# EAGLE design dawa_v5.5 (EAGLE 7.4.0)
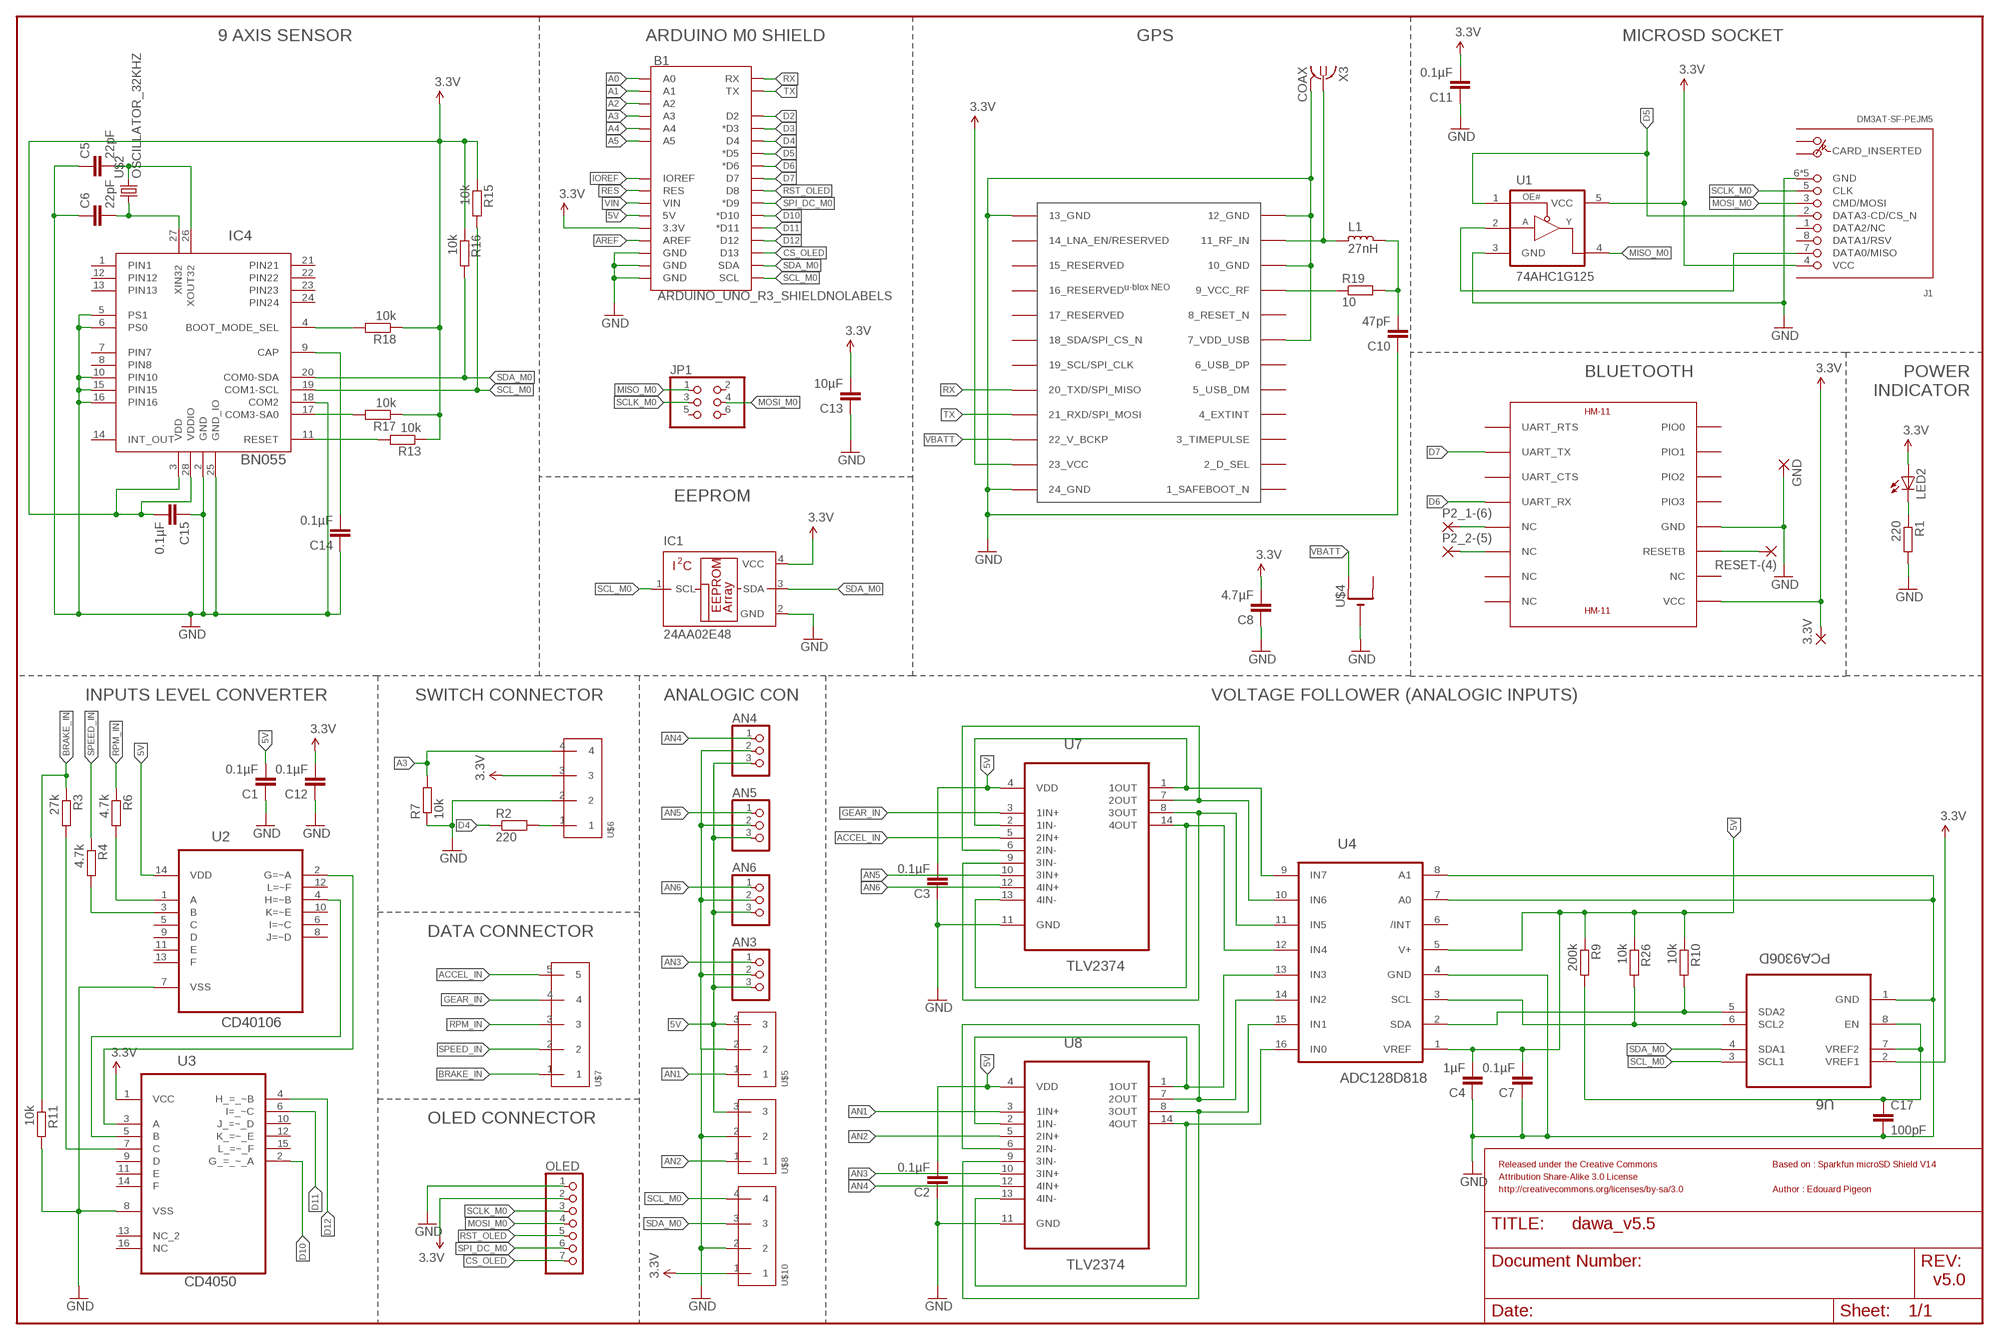
[diagram p0: schematic, sheet 1, part 1 of 2]
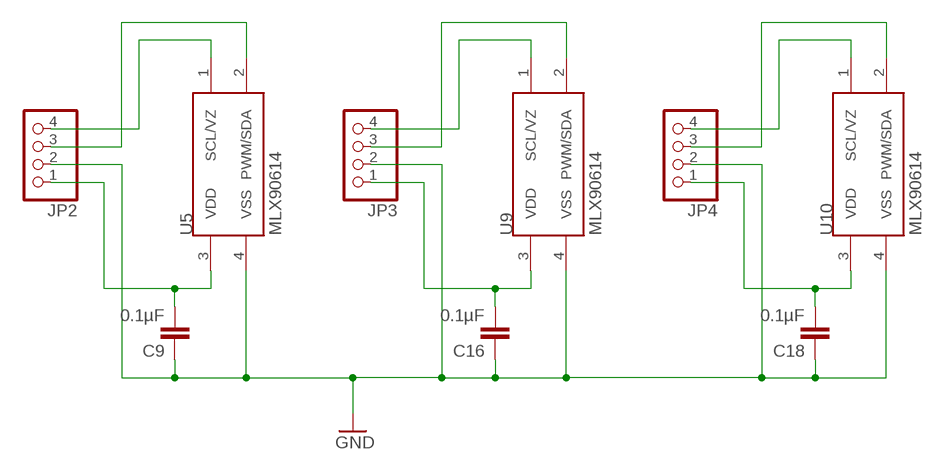
[diagram p1: schematic, sheet 1, part 2 of 2]

## Parts
3.3V  WIREPADSMD1,27-254  [SMD1,27-2,54]
AN3  PINHD-1X3  [1X03]
AN4  PINHD-1X3  [1X03]
AN5  PINHD-1X3  [1X03]
AN6  PINHD-1X3  [1X03]
B1  ARDUINO_UNO_R3_SHIELDNOLABELS  [UNO_R3_SHIELD_NOLABELS]
C1  0.1µF  C-EUC0603  [C0603]
C2  0.1µF  C-EUC0603  [C0603]
C3  0.1µF  C-EUC0603  [C0603]
C4  1µF  C-EUC0603  [C0603]
C5  22pF  C-EUC0603  [C0603]
C6  22pF  C-EUC0603  [C0603]
C7  0.1µF  C-EUC0603  [C0603]
C8  4.7µF  C-EUC0603  [C0603]
C9  0.1µF  C-EUC0603  [C0603]
C10  47pF  C-EUC0603  [C0603]
C11  0.1µF  C-EUC0603  [C0603]
C12  0.1µF  C-EUC0603  [C0603]
C13  10µF  C-EUC0603  [C0603]
C14  0.1µF  C-EUC0603  [C0603]
C15  0.1µF  C-EUC0603  [C0603]
C16  0.1µF  C-EUC0603  [C0603]
C17  100pF  C-EUC0603  [C0603]
C18  0.1µF  C-EUC0603  [C0603]
GND  WIREPADSMD1,27-254  [SMD1,27-2,54]
IC1  24AA02E48  24AA00OT  [SOT23-5L]
IC4  BN055  1658_BNO055  [LGA-28_3.80X5.20/0.5]
J1  DM3AT-SF-PEJM5  [DM3AT-SF-PEJM5]
JP1  PINHD-2X3  [2X03]
JP2  PINHD-1X4  [1X04]
JP3  PINHD-1X4  [1X04]
JP4  PINHD-1X4  [1X04]
L1  27nH  L_0603  [L0603]
LED2  LEDCHIPLED_1206  [CHIPLED_1206]
OLED  PINHD-1X7  [1X07]
P2_1-(6)  WIREPADSMD1,27-254  [SMD1,27-2,54]
P2_2-(5)  WIREPADSMD1,27-254  [SMD1,27-2,54]
R1  220  R-EU_R0603  [R0603]
R2  220  R-EU_R0603  [R0603]
R3  27k  R-EU_R0603  [R0603]
R4  4.7k  R-EU_R0603  [R0603]
R6  4.7k  R-EU_R0603  [R0603]
R7  10k  R-EU_R0603  [R0603]
R9  200k  R-EU_R0603  [R0603]
R10  10k  R-EU_R0603  [R0603]
R11  10k  R-EU_R0603  [R0603]
R13  10k  R-EU_R0603  [R0603]
R15  10k  R-EU_R0603  [R0603]
R16  10k  R-EU_R0603  [R0603]
R17  10k  R-EU_R0603  [R0603]
R18  10k  R-EU_R0603  [R0603]
R19  10  R-EU_M1206  [M1206]
R26  10k  R-EU_R0603  [R0603]
RESET-(4)  WIREPADSMD1,27-254  [SMD1,27-2,54]
U1  74AHC1G125  74AHC1G125DBV  [SOT23-5]
U2  CD40106  CD40106BPW  [SOP65P640X120-14N]
U3  CD4050  CD4049UBPW  [SOP65P640X120-16N]
U4  ADC128D818  [SOP65P640X120-16N]
U5  MLX90614  MLX90614_  [TO-39]
U6  PCA9306D  PCA9306DCUT  [SOP50P310X90-8N]
U7  TLV2374  TLV2374IPWR  [SOP65P640X120-14N]
U8  TLV2374  TLV2374IPWR  [SOP65P640X120-14N]
U9  MLX90614  MLX90614_  [TO-39]
U10  MLX90614  MLX90614_  [TO-39]
U$1  HM-11  [HM-11]
U$2  OSCILLATOR_32KHZ  [OSCILLATOR_SMD]
U$3  NEO-M8  [NEO-M8]
U$4  CR1220SMT  [CR1220-SMD]
U$5  3_PIN_JST-XH-SMD  [3_PIN_JST-XH-SMD]
U$6  4_PIN_JST-XH-SMD  [4_PIN_JST-XH-SMD]
U$7  5_PIN_JST-XH-SMD  [5_PIN_JST-XH-SMD]
U$8  3_PIN_JST-XH-SMD  [3_PIN_JST-XH-SMD]
U$10  4_PIN_JST-XH-SMD  [4_PIN_JST-XH-SMD]
X3  COAX  [MMCX-J-P-X-ST-EM1-MKT]

## Nets
3.3V: 3.3V.1(P) B1.3.3V C8.2 C11.2 C12.2 C13.2 C15.2 IC1.4(VCC) IC4.3(VDD) IC4.28(VDDIO) J1.4(VCC) LED2.A OLED.2 R13.1 R15.1 R16.1 R17.1 R18.1 U1.5(VCC) U3.1(VCC) U6.2(VREF1) U$1.VCC U$3.23(23_VCC) U$6.3 U$10.1
5V: AN3.3 AN4.3 AN5.3 AN6.3 B1.5V C1.2 C2.2 C3.2 C4.2 C7.2 R9.1 R10.1 R26.1 U2.14(VDD) U4.1(VREF) U4.5(V+) U7.4(VDD) U8.4(VDD) U$5.3 U$8.3
A0: B1.A0
A1: B1.A1
A2: B1.A2
A3: B1.A3 R7.2 U$6.4
A4: B1.A4
A5: B1.A5
ACCEL_IN: U7.5(2IN+) U$7.5
AN1: U8.3(1IN+) U$5.1
AN2: U8.5(2IN+) U$8.1
AN3: AN3.1 U8.10(3IN+)
AN4: AN4.1 U8.12(4IN+)
AN5: AN5.1 U7.10(3IN+)
AN6: AN6.1 U7.12(4IN+)
AREF: B1.AREF
BRAKE_IN: R3.1 R11.1 U$7.1
CS_OLED: B1.D13 OLED.7
D2: B1.D2
D3: B1.D3(*D3)
D4: B1.D4 R2.1
D5: B1.D5(*D5) J1.2(DATA3-CD/CS_N) U1.1(OE#)
D6: B1.D6(*D6) U$1.UART_RX
D7: B1.D7 U$1.UART_TX
D10: B1.D10(*D10) U3.2(G_=_~_A)
D11: B1.D11(*D11) U3.6(I=_~C)
D12: B1.D12 U3.4(H_=_~B)
GEAR_IN: U7.3(1IN+) U$7.4
GND: AN3.2 AN4.2 AN5.2 AN6.2 B1.GND@0(GND) B1.GND@1(GND) B1.GND@2(GND) C1.1 C2.1 C3.1 C4.1 C5.1 C6.1 C7.1 C8.1 C9.1 C10.1 C11.1 C12.1 C13.1 C14.1 C15.1 C16.1 C17.2 C18.1 GND.1(P) IC1.2(GND) IC4.2(GND) IC4.5(PS1) IC4.6(PS0) IC4.10(PIN10) IC4.15(PIN15) IC4.16(PIN16) IC4.18(COM2) IC4.25(GND_IO) J1.6(GND) J1.MOUNT0(GND) J1.MOUNT1(GND) J1.MOUNT2(GND) J1.MOUNT3(GND) JP2.2 JP3.2 JP4.2 OLED.1 R1.2 R7.1 R11.2 U1.3(GND) U2.7(VSS) U3.8(VSS) U4.4(GND) U4.7(A0) U4.8(A1) U5.4(VSS) U6.1(GND) U7.11(GND) U8.11(GND) U9.4(VSS) U10.4(VSS) U$1.GND U$3.7(7_VDD_USB) U$3.10(10_GND) U$3.12(12_GND) U$3.13(13_GND) U$3.24(24_GND) U$4.- U$5.2 U$6.2 U$8.2 U$10.2 X3.2@1(GND)
IOREF: B1.IOREF
MISO_M0: JP1.1 U1.4(Y)
MOSI_M0: J1.3(CMD/MOSI) JP1.4 OLED.4
N$1: R2.2 U$6.1
N$2: R6.2 U2.1(A)
N$3: U2.2(G=~A) U3.3(A)
N$4: R4.2 U2.3(B)
N$5: R3.2 U3.7(C)
N$6: LED2.C R1.1
N$7: IC4.11(RESET) R13.2
N$8: P2_1-(6).1(P) U$1.NC@5(NC)
N$9: RESET-(4).1(P) U$1.RESETB
N$10: J1.7(DATA0/MISO) U1.2(A)
N$11: C10.2 L1.1 R19.2
N$12: U4.13(IN3) U8.1(1OUT) U8.2(1IN-)
N$13: C14.2 IC4.9(CAP)
N$14: IC4.4(BOOT_MODE_SEL) R18.2
N$15: C5.2 IC4.26(XOUT32) U$2.2
N$16: C6.2 IC4.27(XIN32) U$2.1
N$17: IC4.17(COM3-SA0) R17.2
N$18: P2_2-(5).1(P) U$1.NC@6(NC)
N$19: R19.1 U$3.9(9_VCC_RF)
N$20: L1.2 U$3.11(11_RF_IN) X3.1
N$21: U2.4(H=~B) U3.5(B)
N$22: R26.2 U4.3(SCL) U6.6(SCL2)
N$23: R10.2 U4.2(SDA) U6.5(SDA2)
N$24: U4.9(IN7) U7.1(1OUT) U7.2(1IN-)
N$25: U4.10(IN6) U7.6(2IN-) U7.7(2OUT)
N$26: U4.11(IN5) U7.8(3OUT) U7.9(3IN-)
N$27: U4.12(IN4) U7.13(4IN-) U7.14(4OUT)
N$28: C17.1 R9.2 U6.7(VREF2) U6.8(EN)
N$29: U4.14(IN2) U8.6(2IN-) U8.7(2OUT)
N$30: U4.15(IN1) U8.8(3OUT) U8.9(3IN-)
N$31: U4.16(IN0) U8.13(4IN-) U8.14(4OUT)
N$32: JP4.3 U10.2(PWM/SDA)
N$33: JP4.4 U10.1(SCL/VZ)
N$34: JP2.3 U5.2(PWM/SDA)
N$35: JP2.4 U5.1(SCL/VZ)
N$36: JP3.3 U9.2(PWM/SDA)
N$37: C9.2 JP2.1 U5.3(VDD)
N$38: JP3.4 U9.1(SCL/VZ)
N$39: C16.2 JP3.1 U9.3(VDD)
N$40: C18.2 JP4.1 U10.3(VDD)
RES: B1.RES
RPM_IN: R6.1 U$7.3
RST_OLED: B1.D8 OLED.5
RX: B1.RX U$3.20(20_TXD/SPI_MISO)
SCL_M0: B1.SCL IC1.1(SCL) IC4.19(COM1-SCL) R15.2 U6.3(SCL1) U$10.4
SCLK_M0: J1.5(CLK) JP1.3 OLED.3
SDA_M0: B1.SDA IC1.3(SDA) IC4.20(COM0-SDA) R16.2 U6.4(SDA1) U$10.3
SPEED_IN: R4.1 U$7.2
SPI_DC_M0: B1.D9(*D9) OLED.6
TX: B1.TX U$3.21(21_RXD/SPI_MOSI)
VBATT: U$3.22(22_V_BCKP) U$4.+$1(+)
VIN: B1.VIN
Unconnected: IC4.1(PIN1) IC4.7(PIN7) IC4.8(PIN8) IC4.12(PIN12) IC4.13(PIN13) IC4.14(INT_OUT) IC4.21(PIN21) IC4.22(PIN22) IC4.23(PIN23) IC4.24(PIN24) J1.1(DATA2/NC) J1.8(DATA1/RSV) J1.A J1.B JP1.2 JP1.5 JP1.6 U2.5(C) U2.6(I=~C) U2.8(J=~D) U2.9(D) U2.10(K=~E) U2.11(E) U2.12(L=~F) U2.13(F) U3.9(D) U3.10(J_=~_D) U3.11(E) U3.12(K_=~_E) U3.13(NC_2) U3.14(F) U3.15(L_=~_F) U3.16(NC) U4.6(/INT) U$1.NC@7(NC) U$1.NC@8(NC) U$1.NC@10(NC) U$1.PIO0 U$1.PIO1 U$1.PIO2 U$1.PIO3 U$1.UART_CTS U$1.UART_RTS U$3.1(1_SAFEBOOT_N) U$3.2(2_D_SEL) U$3.3(3_TIMEPULSE) U$3.4(4_EXTINT) U$3.5(5_USB_DM) U$3.6(6_USB_DP) U$3.8(8_RESET_N) U$3.14(14_LNA_EN/RESERVED) U$3.15(15_RESERVED) U$3.16(16_RESERVED) U$3.17(17_RESERVED) U$3.18(18_SDA/SPI_CS_N) U$3.19(19_SCL/SPI_CLK) U$4.+$2(+1)

## Notes on the sheet
- 9 AXIS SENSOR | ARDUINO M0 SHIELD | GPS | MICROSD SOCKET
- POWER
  INDICATOR
- BLUETOOTH
- EEPROM
- INPUTS LEVEL CONVERTER
- SWITCH CONNECTOR | ANALOGIC CON | VOLTAGE FOLLOWER (ANALOGIC INPUTS)
- DATA CONNECTOR
- OLED CONNECTOR
- Released under the Creative Commons | Based on : Sparkfun microSD Shield V14
- Attribution Share-Alike 3.0 License
- http://creativecommons.org/licenses/by-sa/3.0 | Author : Edouard Pigeon
- v5.0

## Power pins joined to a net without a drawn wire
GND: X3.2@2(GND) X3.2@3(GND) X3.2@4(GND)

## Library data of the parts
3.3V GND P2_1-(6) P2_2-(5) RESET-(4) = wirepad:WIREPAD: Wire PAD connect wire on PCB
AN3-AN6 = adafruit:PINHD-1X3: PIN HEADER
B1 = SparkFun-Boards-resize:ARDUINO_UNO_R3_SHIELD: Arduino R3 Shield Footprint Shield form compatible with the Arduino Uno R3. SparkFun Products: MG2639 Cellular Shield <https://www.sparkfun.com/products/13120> MIDI Shield <https://www.sparkfun.com/products/12898> R3 Stackable Headers Kit <https://www.sparkfun.com/products/11417>
C1-C18 = rcl:C-EU: CAPACITOR, European symbol
IC1 = microchip:24*00: Serial EEPROM 128 bit, I2C (AA = 1.8 V/LC = 2.5 V/C = 5.0 V); MF: MICROCHIP; MPN: 24AA00T-I/OTG; OC_FARNELL: 1331264; OC_NEWARK: 89H3038
IC4 = BNO055-2:1658_BNO055: BN055 Intelligent 9-axis absolute orientation sensor; PART_NUMBER: BNO055
J1 = connector-hirose:DM3AT-SF-PEJM5: CONN MICRO SD R/A PUSH-PUSH SMD; DIGIKEY: HR1964CT-ND
JP1 = pinhead:PINHD-2X3: PIN HEADER
JP2-JP4 = pinhead:PINHD-1X4: PIN HEADER
L1 = rc-master-smd:L_: INDUCTOR
LED2 = led:LED: LED OSRAM: - CHIPLED LG R971, LG N971, LY N971, LG Q971, LY Q971, LO R971, LY R971 LH N974, LH R974 LS Q976, LO Q976, LY Q976 LO Q996 - Hyper CHIPLED LW Q18S LB Q993, LB Q99A, LB R99A - SideLED LS A670, LO A670, LY A670, LG A670, LP A670 LB A673, LV A673, LT A673, LW A673 LH A674 LY A675 LS A676, LA A676, LO A676, LY A676, LW A676 LS A679, LY A679, LG A679 - Hyper Micro SIDELED® LS Y876, LA Y876, LO Y876, LY Y876 LT Y87S - SmartLED LW L88C, LW L88S LB L89C, LB L89S, LG L890 LS L89K, LO L89K, LY L89K LS L896, LA L896, LO L896, LY L896 - TOPLED LS T670, LO T670, LY T670, LG T670, LP T670 LSG T670, LSP T670, LSY T670, LOP T670, LYG T670 LG T671, LOG T671, LSG T671 LB T673, LV T673, LT T673, LW T673 LH T674 LS T676, LA T676, LO T676, LY T676, LB T676, LH T676, LSB T676, LW T676 LB T67C, LV T67C, LT T67C, LS T67K, LO T67K, LY T67K, LW E67C LS E67B, LA E67B, LO E67B, LY E67B, LB E67C, LV E67C, LT E67C LW T67C LS T679, LY T679, LG T679 LS T770, LO T770, LY T770, LG T770, LP T770 LB T773, LV T773, LT T773, LW T773 LH T774 LS E675, LA E675, LY E675, LS T675 LS T776, LA T776, LO T776, LY T776, LB T776 LHGB T686 LT T68C, LB T68C - Hyper Mini TOPLED® LB M676 - Mini TOPLED Santana® LG M470 LS M47K, LO M47K, LY M47K Source: http://www.osram.convergy.de LUXEON: - LUMILED® LXK2-PW12-R00, LXK2-PW12-S00, LXK2-PW14-U00, LXK2-PW14-V00 LXK2-PM12-R00, LXK2-PM12-S00, LXK2-PM14-U00 LXK2-PE12-Q00, LXK2-PE12-R00, LXK2-PE12-S00, LXK2-PE14-T00, LXK2-PE14-U00 LXK2-PB12-K00, LXK2-PB12-L00, LXK2-PB12-M00, LXK2-PB14-N00, LXK2-PB14-P00, LXK2-PB14-Q00 LXK2-PR12-L00, LXK2-PR12-M00, LXK2-PR14-Q00, LXK2-PR14-R00 LXK2-PD12-Q00, LXK2-PD12-R00, LXK2-PD12-S00 LXK2-PH12-R00, LXK2-PH12-S00 LXK2-PL12-P00, LXK2-PL12-Q00, LXK2-PL12-R00 Source: www.luxeon.com KINGBRIGHT: KA-3528ASYC Source: www.kingbright.com
OLED = pinhead:PINHD-1X7: PIN HEADER
R1-R4 R6 R7 R9-R11 R13 R15-R19 R26 = resistor:R-EU_: RESISTOR, European symbol
U1 = 74ah:74AHC1G125: TRI-STATE SINGLE BUSS BUFFER
U2 = TI:CD40106BPW: QUADRUPLE FET BUS SWITCH 2.5-V/3.3-V LOW-VOLTAGE BUS SWITCH WITH 5-V-TOLERANT LEVEL SHIFTER; MPN: CD40106BPW; OC_FARNELL: 1741145; OC_NEWARK: 34R6794; PACKAGE: TSSOP-14; SUPPLIER: Texas Instruments
U3 = TI:CD4049UBPW: CMOS Hex Buffer/Converters; MPN: CD4049UBPW; OC_FARNELL: 1740863; OC_NEWARK: 50R5061; PACKAGE: TSSOP-16; SUPPLIER: Texas Instruments
U4 = ADS128D818-2:ADC128D818: ADC
U5 U9 U10 = SparkFun-MLX:MLX90614: Melexis IR Thermometer
U6 = TI:PCA9306DCUT: VOLTAGE-LEVEL TRANSLATOR; MPN: PCA9306DCUT; OC_FARNELL: -; OC_NEWARK: 24K4705; PACKAGE: VSSOP-8; SUPPLIER: Texas Instruments
U7 U8 = TI:TLV2374IPWR: OPERATIONAL AMPLIFIERS; MPN: TLV2374IPWR; OC_FARNELL: 1575640; OC_NEWARK: 76C7986; PACKAGE: SOIC-14; SUPPLIER: Texas Instruments
U$1 = hm-11:HM-11: JNHuaMao HM-11 Bluetooth 4.0 Transceiver based on TI CC2540/CC2541
U$2 = kanflo:OSCILLATOR_32KHZ: CM7V-T1A Tuning Fork Crystal 32.768 kHz
U$3 = ubloxLib:NEO-M8: u-blox NEO GNSS module
U$4 = adafruit:CR1220: CR1216/CR1220/CR1225 12mm 3V lithium coin cell Great for battery packup. Both SMT and THM holders. Note the THM package has the ground pads on both sides of the PCB so that the masks are the same - this reduces the cost
U$5 U$8 = JST-XH_HEADERS:3_PIN_JST-XH-SMD
U$6 U$10 = JST-XH_HEADERS:4_PIN_JST-XH-SMD
U$7 = JST-XH_HEADERS:5_PIN_JST-XH-SMD
X3 = con-samtec:COAX: MMCX STRAIGHT, EDGE MOUNT JACK- 50 OHM Source: http://www.samtec.com/ftppub/cpdf/MMCX-J-P-X-ST-EM1-MKT.pdf; OC_FARNELL: unknown; OC_NEWARK: unknown

## Board
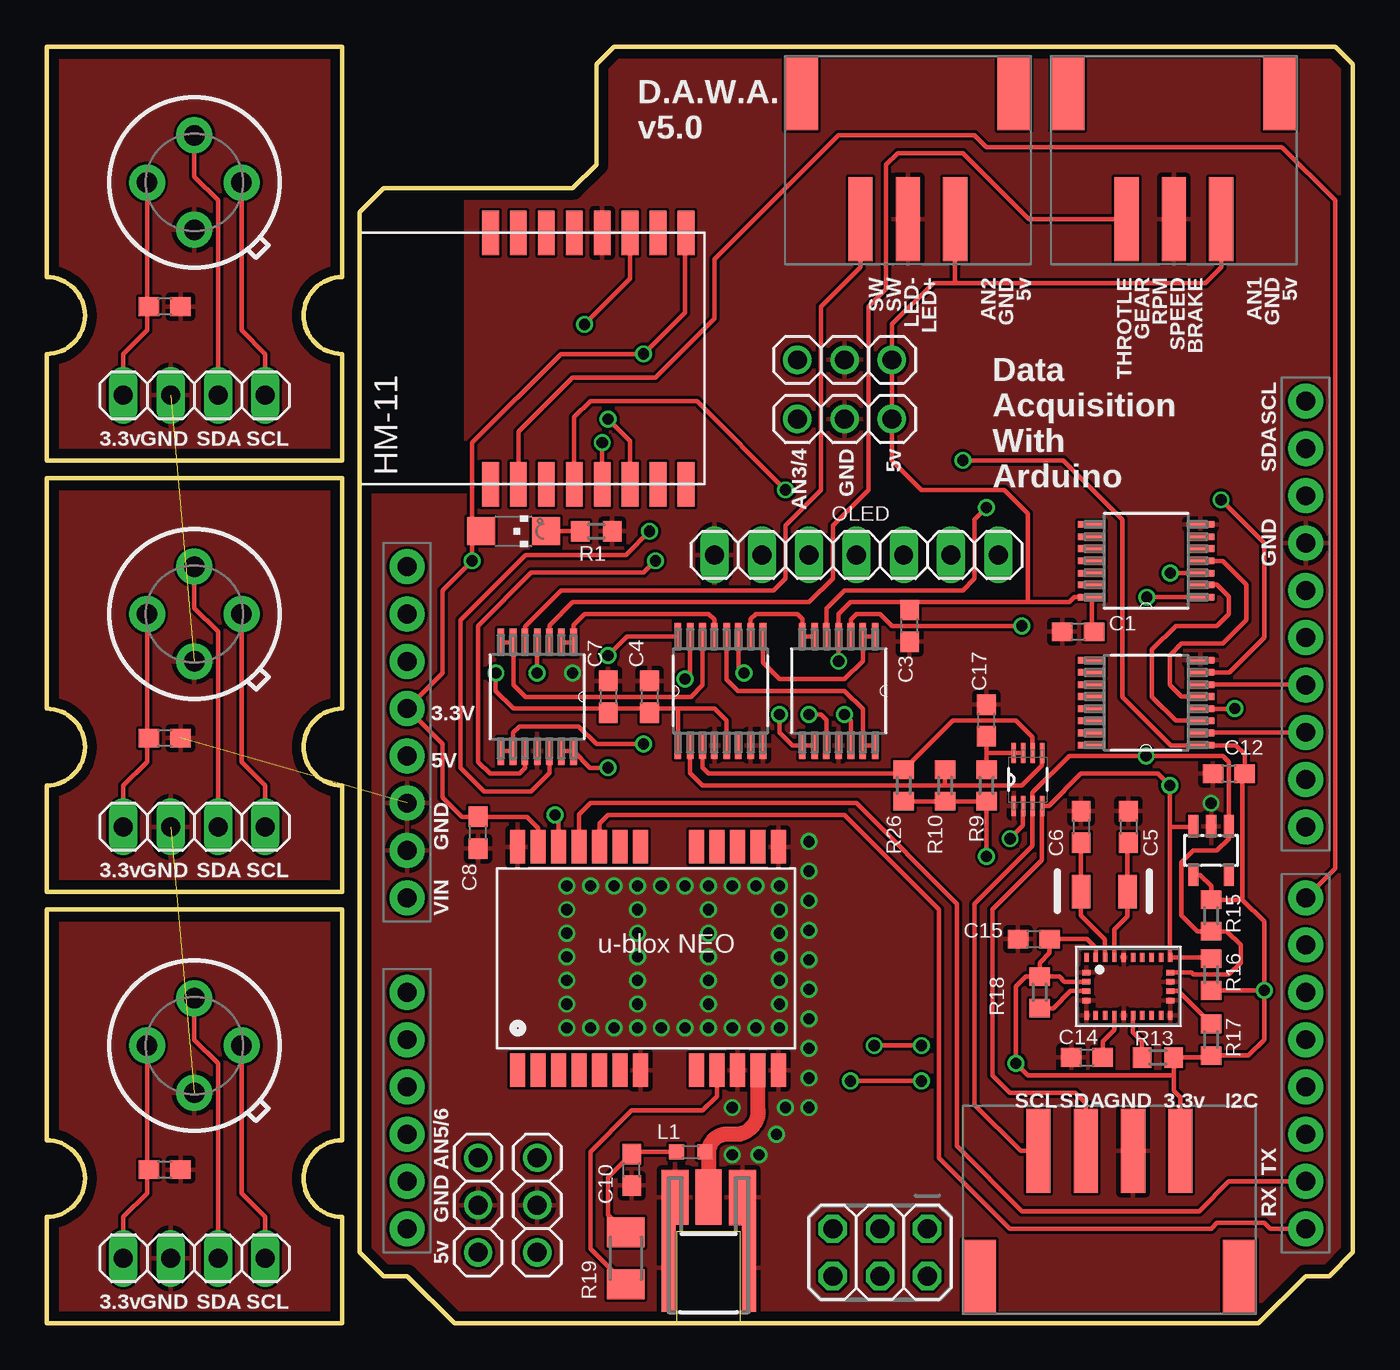
[diagram p2: board, top side]
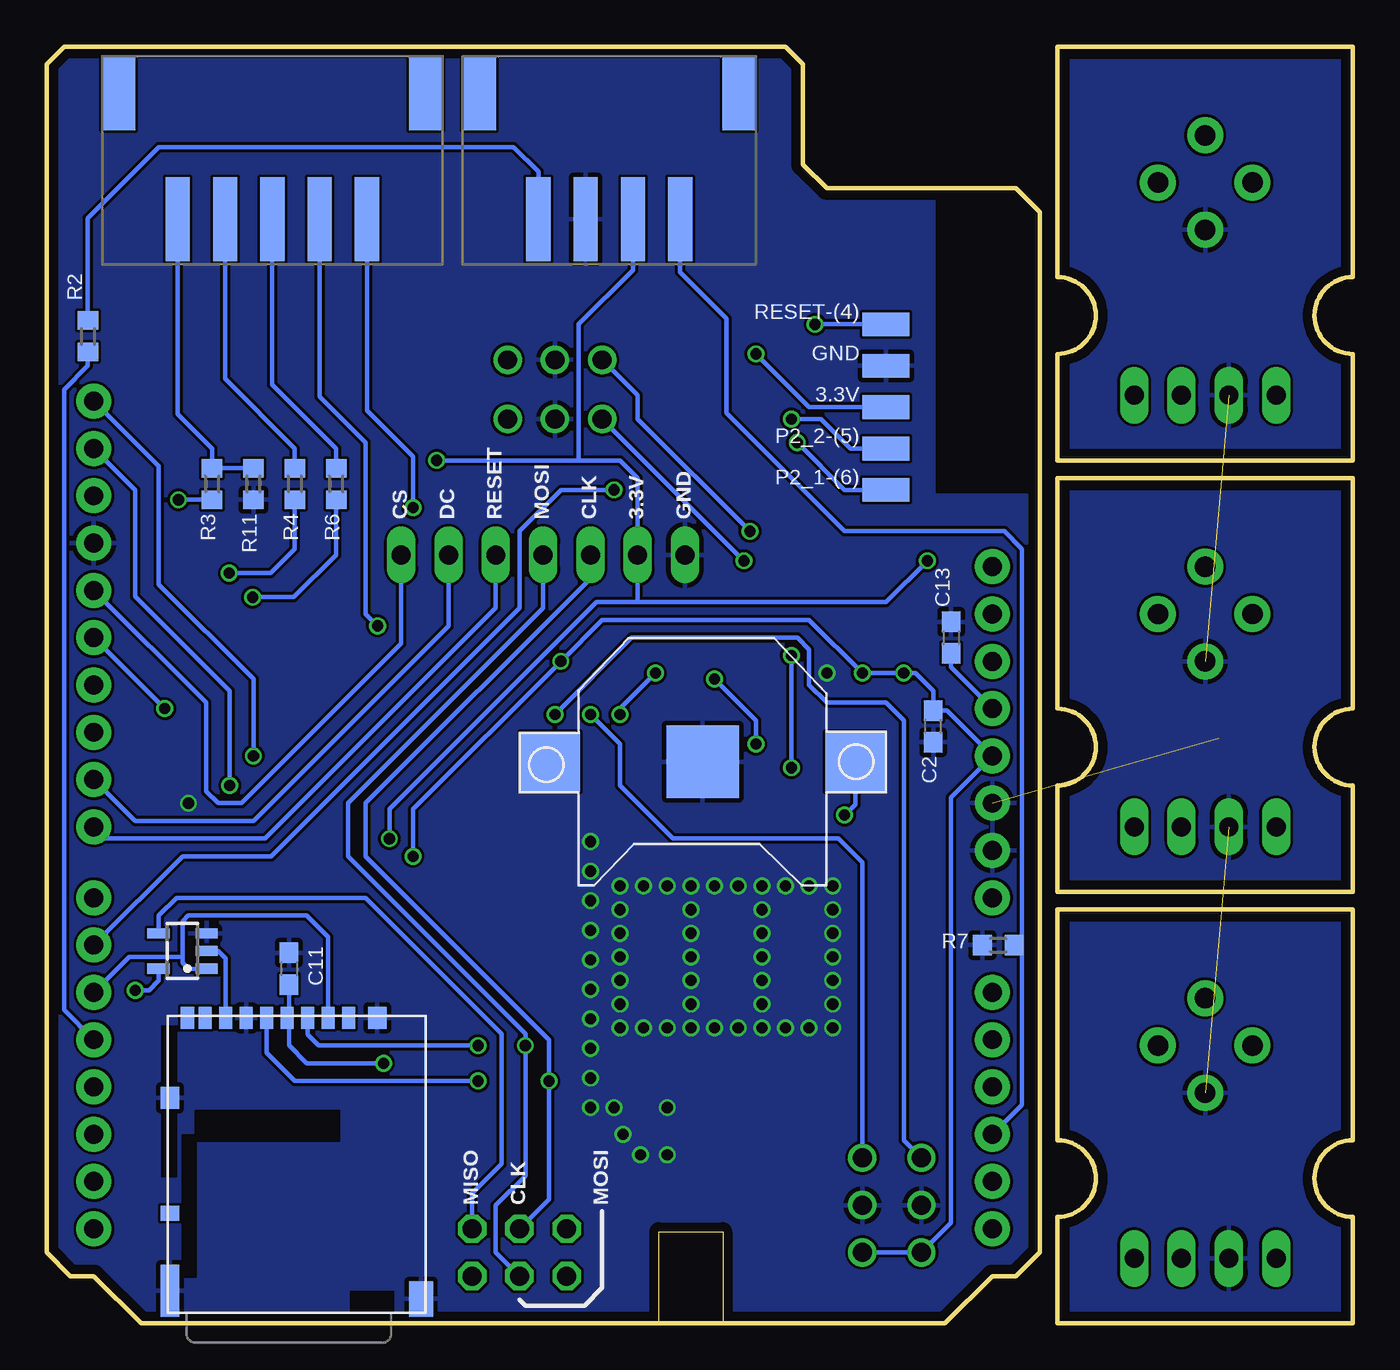
[diagram p3: board, bottom side, seen from below]

Size 70.17 x 68.58 mm. Coordinates in mm from the lower left corner, seen from the top.
Outline: 70.17,67.63 70.17,3.81 68.9,2.54 67.63,2.54 65.09,0 21.91,0 19.37,2.54 18.1,2.54 16.83,3.81 16.83,59.69 18.1,60.96 28.26,60.96 29.53,62.23 29.53,67.63 30.48,68.58 69.22,68.58 70.17,67.63
Outline: 0,22.23 15.87,22.23 15.87,9.84 arc180 15.87,5.71 15.87,0 0,0 0,5.71 arc180 0,9.84 0,22.23
Outline: 0,45.4 15.87,45.4 15.87,33.02 arc180 15.87,28.89 15.87,23.18 0,23.18 0,28.89 arc180 0,33.02 0,45.4
Outline: 0,68.58 15.87,68.58 15.87,56.2 arc180 15.87,52.07 15.87,46.35 0,46.35 0,52.07 arc180 0,56.2 0,68.58
Copper layers (1*16): Top 0.035mm / dielectric 1.6mm / Bottom 0.035mm
Design rules "Elecrow_2-layer_PCB_eagle_rule": minimum track width 6mil, minimum drill 12mil, track to track 6mil, track to pad 6mil, pad to pad 6mil, via to via 8mil, smd to smd 0mil, copper to edge 20mil, drill to drill 10mil, minimum pad ring 6mil, minimum via ring 6mil, stop-mask expansion 0mil, vias tented up to drill 100mil, thermal gap 10mil

### Footprints (pad centres in the part's own frame; a part is rotated, then mirrored left to right if it is on the bottom)
SMD1,27-2,54 = smd 1.27 x 2.54: 1 0,0
1X03 = drill 1.016: 1 -2.54,0; 2 0,0; 3 2.54,0
UNO_R3_SHIELD_NOLABELS = drill 1.016 pad 1.88: 3.3V 24.13,-3.81; 5V 24.13,-1.27; A0 24.13,11.43; A1 24.13,13.97; A2 24.13,16.51; A3 24.13,19.05; A4 24.13,21.59; A5 24.13,24.13; AREF -24.13,-15.24; D2 -24.13,19.05; D3 -24.13,16.51; D4 -24.13,13.97; D5 -24.13,11.43; D6 -24.13,8.89; D7 -24.13,6.35; D8 -24.13,2.54; D9 -24.13,0; D10 -24.13,-2.54; D11 -24.13,-5.08; D12 -24.13,-7.62; D13 -24.13,-10.16; GND@0 24.13,1.27; GND@1 24.13,3.81; GND@2 -24.13,-12.7; IOREF 24.13,-8.89; NC 24.13,-11.43; RES 24.13,-6.35; RX -24.13,24.13; SCL -24.13,-20.32; SDA -24.13,-17.78; TX -24.13,21.59; VIN 24.13,6.35
C0603 = smd 1.1 x 1: 1 -0.85,0; 2 0.85,0
SOT23-5L = smd 0.55 x 1.2: 1 -0.95,-1.3; 2 0,-1.3; 3 0.95,-1.3; 4 0.95,1.3; 5 -0.95,1.3
LGA-28_3.80X5.20/0.5 = smd 0.3 x 0.5: 1 -2.25,1.56; 6 -2.25,-1.56; 7 -1.75,-1.56; 8 -1.25,-1.56; 9 -0.75,-1.56; 10 -0.25,-1.56; 11 0.25,-1.56; 12 0.75,-1.56; 13 1.25,-1.56; 14 1.75,-1.56; 15 2.25,-1.56; 20 2.25,1.56; 21 1.75,1.56; 22 1.25,1.56; 23 0.75,1.56; 24 0.25,1.56; 25 -0.25,1.56; 26 -0.75,1.56; 27 -1.25,1.56; 28 -1.75,1.56 | smd 0.5 x 0.3: 2 -2.25,0.75; 3 -2.25,0.25; 4 -2.25,-0.25; 5 -2.25,-0.75; 16 2.25,-0.75; 17 2.25,-0.25; 18 2.25,0.25; 19 2.25,0.75
DM3AT-SF-PEJM5 = smd 0.7 x 1.2: 1 3.2,-0.1; 2 2.1,-0.1; 3 1,-0.1; 4 -0.1,-0.1; 5 -1.2,-0.1; 6 -2.3,-0.1; 7 -3.4,-0.1; 8 -4.5,-0.1; B -5.45,-0.1 | smd 1 x 0.8: A -6.4,-10.6 | smd 1 x 1.2: MOUNT0 4.75,-0.1; MOUNT1 -6.4,-4.4 | smd 1 x 2.8: MOUNT2 -6.4,-14.75 | smd 1.3 x 1.9: MOUNT3 7.1,-15.2
2X03 = drill 1.016 octagon: 1 -2.54,-1.27; 2 -2.54,1.27; 3 0,-1.27; 4 0,1.27; 5 2.54,-1.27; 6 2.54,1.27
1X04 = drill 1.016 long: 1 -3.81,0; 2 -1.27,0; 3 1.27,0; 4 3.81,0
L0603 = smd 0.8 x 0.8: 1 -0.762,0; 2 0.762,0
CHIPLED_1206 = smd 1.5 x 1.5: A 0,-1.75; C 0,1.75
1X07 = drill 1.016 long: 1 -7.62,0; 2 -5.08,0; 3 -2.54,0; 4 0,0; 5 2.54,0; 6 5.08,0; 7 7.62,0
R0603 = smd 1 x 1.1: 1 -0.85,0; 2 0.85,0
M1206 = smd 1.6 x 2: 1 -1.4,0; 2 1.4,0
SOT23-5 = smd 0.55 x 1.2: 1 -0.95,-1.3; 2 0,-1.3; 3 0.95,-1.3; 4 0.95,1.3; 5 -0.95,1.3
SOP65P640X120-14N = smd 1.473 x 0.356: 1 -2.921,1.956; 2 -2.921,1.295; 3 -2.921,0.66; 4 -2.921,0; 5 -2.921,-0.66; 6 -2.921,-1.295; 7 -2.921,-1.956; 8 2.921,-1.956; 9 2.921,-1.295; 10 2.921,-0.66; 11 2.921,0; 12 2.921,0.66; 13 2.921,1.295; 14 2.921,1.956
SOP65P640X120-16N = smd 1.473 x 0.356: 1 -2.921,2.286; 2 -2.921,1.626; 3 -2.921,0.965; 4 -2.921,0.33; 5 -2.921,-0.33; 6 -2.921,-0.965; 7 -2.921,-1.626; 8 -2.921,-2.286; 9 2.921,-2.286; 10 2.921,-1.626; 11 2.921,-0.965; 12 2.921,-0.33; 13 2.921,0.33; 14 2.921,0.965; 15 2.921,1.626; 16 2.921,2.286
TO-39 = drill 1.1 pad 1.93: 1 2.54,0; 2 0,2.54; 3 -2.54,0; 4 0,-2.54
SOP50P310X90-8N = smd 1.067 x 0.254: 1 -1.422,0.762; 2 -1.422,0.254; 3 -1.422,-0.254; 4 -1.422,-0.762; 5 1.422,-0.762; 6 1.422,-0.254; 7 1.422,0.254; 8 1.422,0.762
HM-11 = smd 2.4 x 0.9: GND 6.5,0; NC@5 -7,0; NC@6 -7,-1.5; NC@7 -7,-3; NC@8 -7,-4.5; NC@10 6.5,-3; PIO0 6.5,6; PIO1 6.5,4.5; PIO2 6.5,3; PIO3 6.5,1.5; RESETB 6.5,-1.5; UART_CTS -7,3; UART_RTS -7,6; UART_RX -7,1.5; UART_TX -7,4.5; VCC 6.5,-4.5
OSCILLATOR_SMD = smd 1 x 1.8: 1 0,0; 2 2.5,0
NEO-M8 = smd 1.8 x 0.8: 1 6.4,-7.4; 2 6.4,-6.3; 3 6.4,-5.2; 4 6.4,-4.1; 5 6.4,-3; 6 6.4,-1.9; 7 6.4,-0.8; 8 6.4,2.2; 9 6.4,3.3; 10 6.4,4.4; 11 6.4,5.5; 12 6.4,6.6; 13 -5.6,6.6; 14 -5.6,5.5; 15 -5.6,4.4; 16 -5.6,3.3; 17 -5.6,2.2; 18 -5.6,-0.8; 19 -5.6,-1.9; 20 -5.6,-3; 21 -5.6,-4.1; 22 -5.6,-5.2; 23 -5.6,-6.3; 24 -5.6,-7.4
CR1220-SMD = smd 3.2 x 3.2: +$1 -8.2,0; +$2 8.2,0 | smd 3.9 x 3.9: - 0,0
3_PIN_JST-XH-SMD = smd 1.3 x 4.5: 1 6.604,-0.889; 2 4.064,-0.889; 3 1.524,-0.889 | smd 1.8 x 3.9: P$1 9.779,-7.62; P$2 -1.651,-7.62
4_PIN_JST-XH-SMD = smd 1.3 x 4.5: 1 6.604,-0.889; 2 4.064,-0.889; 3 1.524,-0.889; 4 -1.016,-0.889 | smd 1.8 x 3.9: P$1 9.779,-7.62; P$2 -4.191,-7.62
5_PIN_JST-XH-SMD = smd 1.3 x 4.5: 1 6.604,-0.889; 2 4.064,-0.889; 3 1.524,-0.889; 4 -1.016,-0.889; 5 -3.556,-0.889 | smd 1.8 x 3.9: P$1 9.779,-7.62; P$2 -6.731,-7.62
MMCX-J-P-X-ST-EM1-MKT = smd 1.4 x 2.975: 1 0,-6.15 | smd 1.46 x 2.975: 2@1 -1.812,-6.125; 2@2 1.812,-6.138 | smd 0.76 x 4.7: 2@3 -2.163,-2.35; 2@4 2.163,-2.35

### Placement (x,y rotation side)
3.3V  25.08,49.21 90 bottom
AN3  42.86,48.58 0 top
AN4  42.86,51.75 0 top
AN5  26.35,6.35 270 top
AN6  23.18,6.35 270 top
B1  43.5,29.21 180 top
C1  55.4,37.15 0 top
C2  22.54,32.07 90 bottom
C3  46.36,37.47 90 top
C4  32.38,33.66 270 top
C5  58.1,26.67 270 top
C6  55.56,26.67 270 top
C7  30.16,33.66 270 top
C8  23.18,26.35 90 top
C9  6.35,8.25 180 top
C10  31.43,8.25 90 top
C11  57.15,19.05 270 bottom
C12  63.5,29.53 0 top
C13  21.59,36.83 270 bottom
C14  55.88,14.29 0 top
C15  53.02,20.64 0 top
C16  6.35,31.43 180 top
C17  50.48,32.38 90 top
C18  6.35,54.61 180 top
GND  25.08,51.44 90 bottom
IC1  62.55,25.4 180 top
IC4  58.1,18.1 0 top
J1  57.15,16.51 0 bottom
JP1  44.77,3.81 180 top
JP2  7.94,3.49 0 top
JP3  7.94,26.67 0 top
JP4  7.94,49.85 0 top
L1  34.61,9.21 0 top
LED2  25.08,42.55 270 top
OLED  43.5,41.27 0 top
P2_1-(6)  25.08,44.77 90 bottom
P2_2-(5)  25.08,46.99 90 bottom
R1  29.53,42.55 0 top
R2  67.94,53.02 90 bottom
R3  61.28,45.09 270 bottom
R4  56.83,45.09 270 bottom
R6  54.61,45.09 270 bottom
R7  19.05,20.32 0 bottom
R9  50.48,28.89 90 top
R10  48.26,28.89 90 top
R11  59.05,45.09 270 bottom
R13  59.69,14.29 180 top
R15  62.55,21.91 270 top
R16  62.55,18.73 90 top
R17  62.55,15.24 90 top
R18  53.34,17.78 270 top
R19  31.12,3.49 90 top
R26  46.04,28.89 90 top
RESET-(4)  25.08,53.66 90 bottom
U1  62.87,20 90 bottom
U2  59.05,40.96 180 top
U3  59.05,33.34 180 top
U4  36.2,33.97 90 top
U5  7.94,14.92 0 top
U6  52.7,29.21 90 top
U7  42.55,33.97 270 top
U8  26.35,33.66 270 top
U9  7.94,38.1 0 top
U10  7.94,61.28 0 top
U$1  29.85,52.07 90 top
U$2  55.56,23.18 0 top
U$3  32.7,20 270 top
U$4  34.92,30.16 180 bottom
U$5  64.61,58.42 180 top
U$6  37.15,58.42 180 bottom
U$7  56.52,58.42 180 bottom
U$8  50.32,58.42 180 top
U$10  54.29,10.16 0 top
X3  35.56,0.63 180 top

### Tracks (layer width: path | path; a pad name or v marks a point on that pad's centre or on a via)
3.3V  (via drill 0.6)
  Top 0.254: 60.54,13.33 52.7,13.33 v52.07,13.97 52.07,18.1 52.6,18.63 R18.1 | IC4.3 54.68,18.35 54.4,18.63 R18.1 | IC4.28 56.35,20.17 55.88,20.64 C15.2 53.87,19.9 53.34,19.37 R18.1 | v65.41,17.88 65.41,15.24 64.55,14.39 R17.1 62.13,14.29 R13.1 60.54,13.33 | v65.41,17.88 65.41,21.59 64.24,22.76 | 64.24,22.76 R15.1 62.55,23.5 61.94,24.1 IC1.4 | U$3.23 26.4,26.62 25.82,27.2 C8.2 22.33,27.2 21.27,28.26 21.27,31.11 B1.3.3V 21.27,34.93 21.27,39.37 v22.86,40.96 22.86,42.07 LED2.A 22.86,43.02 22.86,47.31 27.62,52.07 v32.07,52.07 34.29,54.29 34.29,58.52 U$1.VCC | 64.24,22.76 64.24,29.42 C12.2 64.35,30.58 63.88,31.05 U3.1 60.39,31.05 57.79,33.65 57.79,43.18 54.61,46.35 v49.21,46.35 | U6.2 52.45,26.73 v51.75,26.03 | 60.54,13.33 60.54,12.48 60.9,12.13 U$10.1 | R16.1 v65.41,17.88
  Bottom 0.254: C11.2 57.15,16.51 | 57.15,16.51 J1.4 | 57.15,16.51 57.15,14.92 56.2,13.97 v52.07,13.97 | C13.2 21.59,35.24 B1.3.3V | v22.86,40.96 25.08,38.74 38.42,38.74 | 38.42,38.74 40.64,38.74 51.75,27.62 v51.75,26.03 | 38.42,38.74 OLED.2 38.42,45.4 39.37,46.35 41.59,46.35 | 3.3V.1 29.21,49.21 v32.07,52.07 | v49.21,46.35 41.59,46.35 | U$6.3 38.67,56.58 41.59,53.66 41.59,46.35 | v65.41,17.88 64.67,17.88 64.13,18.42 64.13,19.02 U1.5
5V  (via drill 0.6)
  Top 0.254: 46.36,38.74 43.18,38.74 42.55,38.1 U7.4 v42.55,35.56 | 46.36,38.74 52.7,38.74 | 52.7,38.74 54.93,38.74 55.19,39 U2.14 56.13,37.27 C1.2 | U8.4 v26.35,34.93 | 30.16,33.02 32.39,33.02 C4.2 32.6,33.02 33.91,33.02 | 30.16,33.02 25.08,33.02 24.13,33.97 v24.13,34.93 | C7.2 30.16,33.02 | R26.1 R10.1 R9.1 v50.48,25.08 | C3.2 46.36,38.74 | U4.5 36.53,32.37 35.88,33.02 33.91,33.02 | U4.1 33.91,33.02 | 52.7,38.74 52.7,43.5 51.44,44.77 46.99,44.77 45.4,46.35 AN3.3 AN4.3 45.4,53.66 47.62,55.88 48.9,55.88 | U$5.3 63.09,56.74 62.23,55.88 48.9,55.88 | U$8.3 48.8,55.98 48.9,55.88
  Bottom 0.254: v50.48,25.08 50.48,27.62 v42.55,35.56 40.32,37.78 29.21,37.78 v26.35,34.93 v24.13,34.93 23.5,34.93 22.54,33.97 C2.2 21.8,32.92 B1.5V 21.59,28.26 21.59,5.4 AN6.3 AN5.3
A3
  Bottom 0.254: B1.A3 17.78,11.75 17.78,20.32 | 17.78,20.32 17.78,41.59 18.73,42.55 27.3,42.55 33.66,48.89 33.66,53.98 36.13,56.45 U$6.4 | R7.2 17.78,20.32
ACCEL_IN  (via drill 0.6)
  Top 0.254: U7.5 41.88,38.39 42.86,39.37 49.21,39.37 49.85,40 49.85,43.18 v50.48,43.81
  Bottom 0.254: v50.48,43.81 50.48,46.55 52.96,49.02 U$7.5
AN1
  Top 0.254: U8.3 27.01,37.49 28.26,38.74 40.96,38.74 42.23,40 42.23,42.86 44.13,44.77 44.13,54.61 45.09,55.56 45.09,62.23 45.72,62.87 49.21,62.87 52.77,59.31 U$5.1
AN2
  Top 0.254: U8.5 25.69,37.44 27.62,39.37 39.05,39.37 39.69,40 39.69,42.86 41.59,44.77 41.59,54.61 43.72,56.74 U$8.1
AN3  (via drill 0.6)
  Top 0.254: U8.10 25.69,29.82 25.4,29.53 23.81,29.53 23.18,30.16 23.18,37.47 26.03,40.32 32.07,40.32 v32.7,40.96
  Bottom 0.254: AN3.1 v32.7,40.96
AN4  (via drill 0.6)
  Top 0.254: U8.12 27.01,29.55 26.03,28.58 23.5,28.58 22.23,29.84 22.23,37.78 25.72,41.27 31.12,41.27 v32.39,42.55
  Bottom 0.254: AN4.1 38.42,49.85 38.42,48.58 v32.39,42.55
AN5  (via drill 0.6)
  Top 0.254: U7.10 41.88,32.41 41.59,32.7 v40.96,32.7
  Bottom 0.254: AN5.1 26.35,24.76 27.62,26.03 36.51,26.03 39.37,28.89 39.37,31.11 v40.96,32.7
AN6  (via drill 0.6)
  Top 0.254: U7.12 43.21,32.36 v42.86,32.7
  Bottom 0.254: v42.86,32.7 38.73,36.83 29.85,36.83 29.21,36.2 29.21,34.29 28.26,33.34 25.08,33.34 24.13,32.38 24.13,9.84 AN6.1
BRAKE_IN
  Bottom 0.254: R11.1 R3.1 61.28,46.99 63.12,48.83 U$7.1
CS_OLED
  Bottom 0.254: B1.D13 61.59,33.34 61.59,28.58 60.96,27.94 59.69,27.94 51.12,36.51 OLED.7
D4
  Bottom 0.254: B1.D4 69.22,16.83 69.22,50.17 67.94,51.44 R2.1
D5
  Bottom 0.254: J1.2 55.05,20.76 56.2,21.91 62.55,21.91 62.87,21.59 62.87,19.68 | 62.87,19.68 62.87,19.37 62.55,19.05 U1.1 | 62.87,19.68 65.72,19.68 B1.D5
D6  (via drill 0.6)
  Top 0.254: U$1.UART_RX 28.35,48.67 29.21,49.53 34.92,49.53 v39.69,44.77
  Bottom 0.254: B1.D6 62.87,25.08 58.1,25.08 44.77,38.42 44.77,42.55 42.55,44.77 v39.69,44.77
D7
  Top 0.254: B1.D7 69.22,24.45 69.22,60.32 66.36,63.18 50.48,63.18 49.85,63.82 42.55,63.82 35.88,57.15 35.88,53.98 32.7,50.8 28.26,50.8 25.35,47.89 U$1.UART_TX
D10
  Top 0.254: B1.D10 62.01,31.75 U3.2
D11
  Top 0.254: U3.6 67.61,34.3 B1.D11
D12  (via drill 0.6)
  Top 0.254: v63.82,33.02 63.8,33.01 U3.4
  Bottom 0.254: B1.D12 v63.82,33.02
GEAR_IN  (via drill 0.6)
  Top 0.254: U7.3 43.21,37.81 43.5,38.1 44.77,38.1 45.4,37.47 v52.39,37.47
  Bottom 0.254: v52.39,37.47 52.86,37.94 53.02,38.1 53.02,47.31 55.5,49.78 U$7.4
GND  (via drill 0.6)  (3 unrouted)
  Top 0.254: IC4.25 57.83,19.68 57.79,19.68
  other vias: 38.26,9.05 39.37,15.88 39.37,17.14 39.37,18.41 39.37,19.68 39.37,20.95 39.37,22.23 39.37,23.49 38.1,23.49 36.83,23.49 35.56,23.49 34.29,23.49 33.02,23.49 38.1,15.88 36.83,15.88 35.56,15.88 34.29,15.88 33.02,15.88 31.75,15.88 30.48,15.88 29.21,15.88 31.75,23.49 30.48,23.49 29.21,23.49 27.94,23.49 35.56,17.14 31.75,17.14 27.94,18.41 27.94,19.68 27.94,20.95 27.94,22.23 31.75,18.41 31.75,19.68 31.75,20.95 31.75,22.23 35.56,18.41 35.56,19.68 35.56,20.95 35.56,22.23 27.94,17.14 27.94,15.88 39.21,10.16 36.83,11.59 36.83,9.05 40.96,13.18 40.96,14.76 40.96,16.35 40.96,17.94 40.96,19.53 40.96,21.11 40.96,22.7 40.96,24.29 39.69,11.59 40.96,11.59 28.26,34.92 62.55,27.94 40.96,25.88
  pour Bottom: 69.22,68.58 70.17,67.63 70.17,3.81 68.9,2.54 67.63,2.54 65.09,0 21.91,0 19.37,2.54 18.1,2.54 16.83,3.81 16.83,44.45 22.54,44.45 22.54,60.96 28.26,60.96 29.53,62.23 29.53,67.63 30.48,68.58
  pour Top: 69.22,68.58 70.17,67.63 70.17,3.81 68.9,2.54 67.63,2.54 65.09,0 21.91,0 19.37,2.54 18.1,2.54 16.83,3.81 16.83,44.45 22.54,44.45 22.54,60.96 28.26,60.96 29.53,62.23 29.53,67.63 30.48,68.58
  pour Top: 15.24,44.77 0.63,44.77 0.63,23.81 15.24,23.81
  pour Top: 15.24,21.59 0.63,21.59 0.63,0.63 15.24,0.63
  pour Top: 15.24,44.77 0.63,44.77 0.63,23.81 15.24,23.81
  pour Top: 15.24,67.94 0.63,67.94 0.63,46.99 15.24,46.99
  pour Bottom: 0.63,67.94 15.24,67.94 15.24,46.99 0.63,46.99
  pour Bottom: 0.63,44.77 15.24,44.77 15.24,23.81 0.63,23.81
  pour Bottom: 0.63,21.59 15.24,21.59 15.24,0.63 0.63,0.63
MISO_M0
  Bottom 0.254: JP1.1 47.31,6.98 45.72,8.57 45.72,15.56 53.02,22.86 63.18,22.86 64.13,21.91 64.13,20.98 U1.4
MOSI_M0  (via drill 0.6)
  Top 0.254: v46.99,14.92 v44.45,14.92
  Bottom 0.254: JP1.4 46.04,3.81 46.04,6.35 44.45,7.94 v44.45,14.92 44.45,15.56 53.98,25.08 53.98,27.94 43.5,38.42 OLED.4 | J1.3 56.15,15.51 55.56,14.92 v46.99,14.92
N$1
  Bottom 0.254: R2.2 67.94,59.37 64.13,63.18 45.09,63.18 43.75,61.85 U$6.1
N$2  (via drill 0.6)
  Top 0.254: U2.1 v59.11,39
  Bottom 0.254: v59.11,39 56.88,39 54.61,41.27 R6.2
N$3
  Top 0.254: U3.3 61.93,32.37 61.91,32.38 60.64,32.38 59.37,33.65 59.37,36.2 60.64,37.47 62.87,37.47 63.5,38.1 63.5,39.05 62.87,39.69 62,39.69 U2.2
N$4  (via drill 0.6)
  Top 0.254: U2.3 v60.35,40.3
  Bottom 0.254: v60.35,40.3 58.13,40.3 56.83,41.59 R4.2
N$5  (via drill 0.6)
  Top 0.254: U3.7 63.54,34.96 65.41,36.83 65.41,41.91 v63.08,44.24
  Bottom 0.254: R3.2 v63.08,44.24
N$6
  Top 0.254: LED2.C R1.1
N$7
  Top 0.254: IC4.11 58.35,15.62 58.84,15.14 R13.2
N$8  (via drill 0.6)
  Top 0.254: U$1.NC@5 v29.85,47.31
  Bottom 0.254: v29.85,47.31 27.3,44.77 P2_1-(6).1
N$9  (via drill 0.6)
  Top 0.254: U$1.RESETB 31.35,56.11 v28.89,53.66
  Bottom 0.254: v28.89,53.66 RESET-(4).1
N$10
  Bottom 0.254: J1.7 60.55,19.59 60.96,20 U1.2
N$11
  Top 0.254: L1.1 31.53,9.21 C10.2 30.16,7.83 30.16,5.84 R19.2
N$12
  Top 0.254: U8.2 U8.1 28.31,37.52 28.89,38.1 35.56,38.1 35.86,37.8 U4.13
N$13
  Top 0.254: IC4.9 57.35,15.76 56.73,15.14 C14.2
N$14
  Top 0.254: IC4.4 54.99,17.85 54.08,16.93 R18.2
N$15
  Top 0.254: IC4.26 57.35,21.16 58.06,21.87 U$2.2 58.06,25.78 C5.2
N$16
  Top 0.254: IC4.27 56.85,20.62 55.56,21.91 U$2.1 C6.2
N$17
  Top 0.254: IC4.17 60.79,17.85 R17.2
N$18  (via drill 0.6)
  Top 0.254: U$1.NC@6 31.35,47.39 v30.16,48.58
  Bottom 0.254: v30.16,48.58 28.57,48.58 26.99,46.99 P2_2-(5).1
N$19
  Top 0.254: U$3.9 36,12.19 35.24,11.43 31.43,11.43 29.21,9.21 29.21,4 R19.1
N$20
  Top 0.254: U$3.11 37.91,13.6 | L1.2 35.56,9.21
  Top 0.813: U$3.11 38.2,11.53 arc-90 37.15,10.16 36.51,10.16 arc90 35.56,9.21 X3.1
N$21
  Top 0.254: U3.5 60.95,33.67 60.33,34.29 60.33,35.88 60.96,36.51 63.18,36.51 64.45,37.78 64.45,39.69 63.18,40.96 U2.4
N$22
  Top 0.254: U6.6 52.96,31.5 52.07,32.38 48.68,32.38 R26.2 45.82,29.53 35.56,29.53 35.23,29.86 U4.3
N$23
  Top 0.254: U6.5 53.47,29.97 52.39,28.89 48.26,28.89 | R10.2 48.26,28.89 | 48.26,28.89 35.24,28.89 34.57,29.57 U4.2
N$24
  Top 0.254: U7.1 U7.2 43.84,35.59 42.86,34.61 39.37,34.61 38.48,35.5 U4.9
N$25
  Top 0.254: U7.6 U7.7 40.59,37.83 40.32,38.1 38.1,38.1 37.82,37.82 U4.10
N$26  (via drill 0.6)
  Top 0.254: U4.11 37.16,35.23 v37.47,34.93 | 39.37,32.44 v39.37,32.7 39.37,31.75 40.07,31.05 U7.8 U7.9
  Bottom 0.254: v37.47,34.93 39.37,33.02 v39.37,32.7
N$27
  Top 0.254: U7.14 U7.13 43.84,32.99 42.86,33.97 37.15,33.97 36.53,34.59 U4.12
N$28
  Top 0.254: U6.7 U6.8 50.48,30.63 | C17.1 50.48,30.63 | 50.48,30.63 R9.2
N$29
  Top 0.254: U8.7 U8.6 25.08,36.87 25.08,34.29 25.72,33.65 34.61,33.65 35.23,34.28 U4.14
N$30  (via drill 0.6)
  Top 0.254: v32.07,31.11 29.53,31.11 28.57,32.07 25.4,32.07 25.06,31.72 U8.9 U8.8 | U4.15 34.57,34.89 v34.29,34.61
  Bottom 0.254: v32.07,31.11 32.07,32.38 v34.29,34.61
N$31  (via drill 0.6)
  Top 0.254: U8.14 U8.13 27.62,31.03 | 28.37,31.11 U8.14 | v30.16,35.88 31.18,36.89 U4.16 | v30.16,29.84 29.2,29.84 U8.14
  Bottom 0.254: v30.16,35.88 v30.16,29.84
N$32
  Top 0.254: U10.2 7.94,61.59 9.21,60.32 JP4.3
N$33
  Top 0.254: U10.1 10.48,53.34 11.75,52.07 JP4.4
N$34
  Top 0.254: U5.2 7.94,15.24 9.21,13.97 JP2.3
N$35
  Top 0.254: U5.1 10.48,6.98 11.75,5.71 JP2.4
N$36
  Top 0.254: U9.2 7.94,38.42 9.21,37.15 JP3.3
N$37
  Top 0.254: U5.3 5.4,8.25 | 5.4,8.25 5.4,6.98 4.13,5.71 JP2.1 | C9.2 5.4,8.25
N$38
  Top 0.254: U9.1 10.48,30.16 11.75,28.89 JP3.4
N$39
  Top 0.254: JP3.1 4.13,28.89 5.4,30.16 5.4,31.43 | U9.3 5.4,31.43 | C16.2 5.4,31.43
N$40
  Top 0.254: U10.3 5.4,54.61 | 5.4,54.61 5.4,53.34 4.13,52.07 JP4.1 | C18.2 5.4,54.61
RPM_IN
  Bottom 0.254: R6.1 54.61,46.99 58.04,50.42 U$7.3
RST_OLED
  Bottom 0.254: B1.D8 66.99,26.03 58.42,26.03 46.04,38.42 OLED.5
RX
  Top 0.254: U$3.20 29.7,26.84 30.16,27.31 42.86,27.31 47.94,22.23 47.94,8.89 51.75,5.08 62.55,5.08 62.87,5.4 65.41,5.4 65.72,5.08 B1.RX
SCL_M0  (via drill 0.6)
  Top 0.254: IC4.19 61.48,18.85 61.59,18.73 63.5,18.73 64.13,19.37 64.13,20.32 63.4,21.06 R15.2 61.81,21.06 60.96,21.91 60.96,24.76 61.59,25.4 62.87,25.4 63.5,26.03 IC1.1 63.5,30.17 63.18,30.48 v59.05,30.48 54.93,30.48 52.96,28.51 U6.3 52.96,25.65 49.85,22.54 49.85,11.75 52.32,9.27 U$10.4
  Bottom 0.254: B1.SCL 64.13,46.04 64.13,39.69 59.05,34.61 v59.05,30.48
SCLK_M0  (via drill 0.6)
  Top 0.254: v46.99,13.02 v43.18,13.02
  Bottom 0.254: JP1.3 43.18,6.67 v43.18,13.02 43.18,15.24 53.02,25.08 53.02,27.94 40.96,40 OLED.3 | J1.5 58.35,14.54 56.83,13.02 v46.99,13.02
SDA_M0  (via drill 0.6)
  Top 0.254: R16.2 62.47,19.66 IC4.20 60.33,19.68 60.33,26.67 | 60.33,26.67 v60.33,28.89 59.69,29.53 55.56,29.53 53.82,27.79 U6.4 53.47,24.89 50.8,22.23 50.8,13.33 51.75,12.38 55.24,12.38 55.82,11.81 U$10.3 | IC1.3 61.57,26.67 60.33,26.67
  Bottom 0.254: B1.SDA 65.41,44.77 65.41,39.05 60.33,33.97 v60.33,28.89
SPEED_IN
  Bottom 0.254: R4.1 56.83,46.99 60.58,50.74 U$7.2
SPI_DC_M0
  Bottom 0.254: B1.D9 65.41,26.99 59.05,26.99 48.58,37.47 OLED.6
TX
  Top 0.254: B1.TX 63.5,7.62 61.91,6.03 52.39,6.03 48.9,9.52 48.9,22.54 43.5,27.94 29.21,27.94 28.6,27.33 U$3.21
VBATT  (via drill 0.6)
  Top 0.254: U$3.22 27.5,27.11 v27.3,27.31
  Bottom 0.254: v27.3,27.31 26.73,27.88 U$4.+$1

### Text on the board
tPlace: D.A.W.A. / v5.0 | SW | SW | LED- | LED+ | AN2 | GND | 5v | THROTLE | GEAR | RPM | SPEED | BRAKE | AN1 | GND | 5v | SCL | 3.3v | GND | SDA | SCL | AN3/4 | GND | 5v | SDA | Data / Acquisition / With / Arduino | GND | 3.3V | 5V | GND | 3.3v | GND | SDA | SCL | VIN | SCL | SDA | GND | 3.3v | I2C | AN5/6 | TX | GND | RX | 5v | 3.3v | GND | SDA | SCL
bPlace: GND | 3.3V | CLK | MOSI | RESET | DC | CS | MOSI | CLK | MISO